# EasyEDA Pro project ProPrj_AT89C52_LCD12864_2025-10-14.epro

# Schematic Schematic1
Board Name: Board1; Create Date: 2025-06-17; Page Name: P1; Project Name: AT89C52_LCD12864; Schematic Name: Schematic1; Update Date: 2025-09-18; Company: 嘉立创EDA; Page Size: A4; Version: V1.0
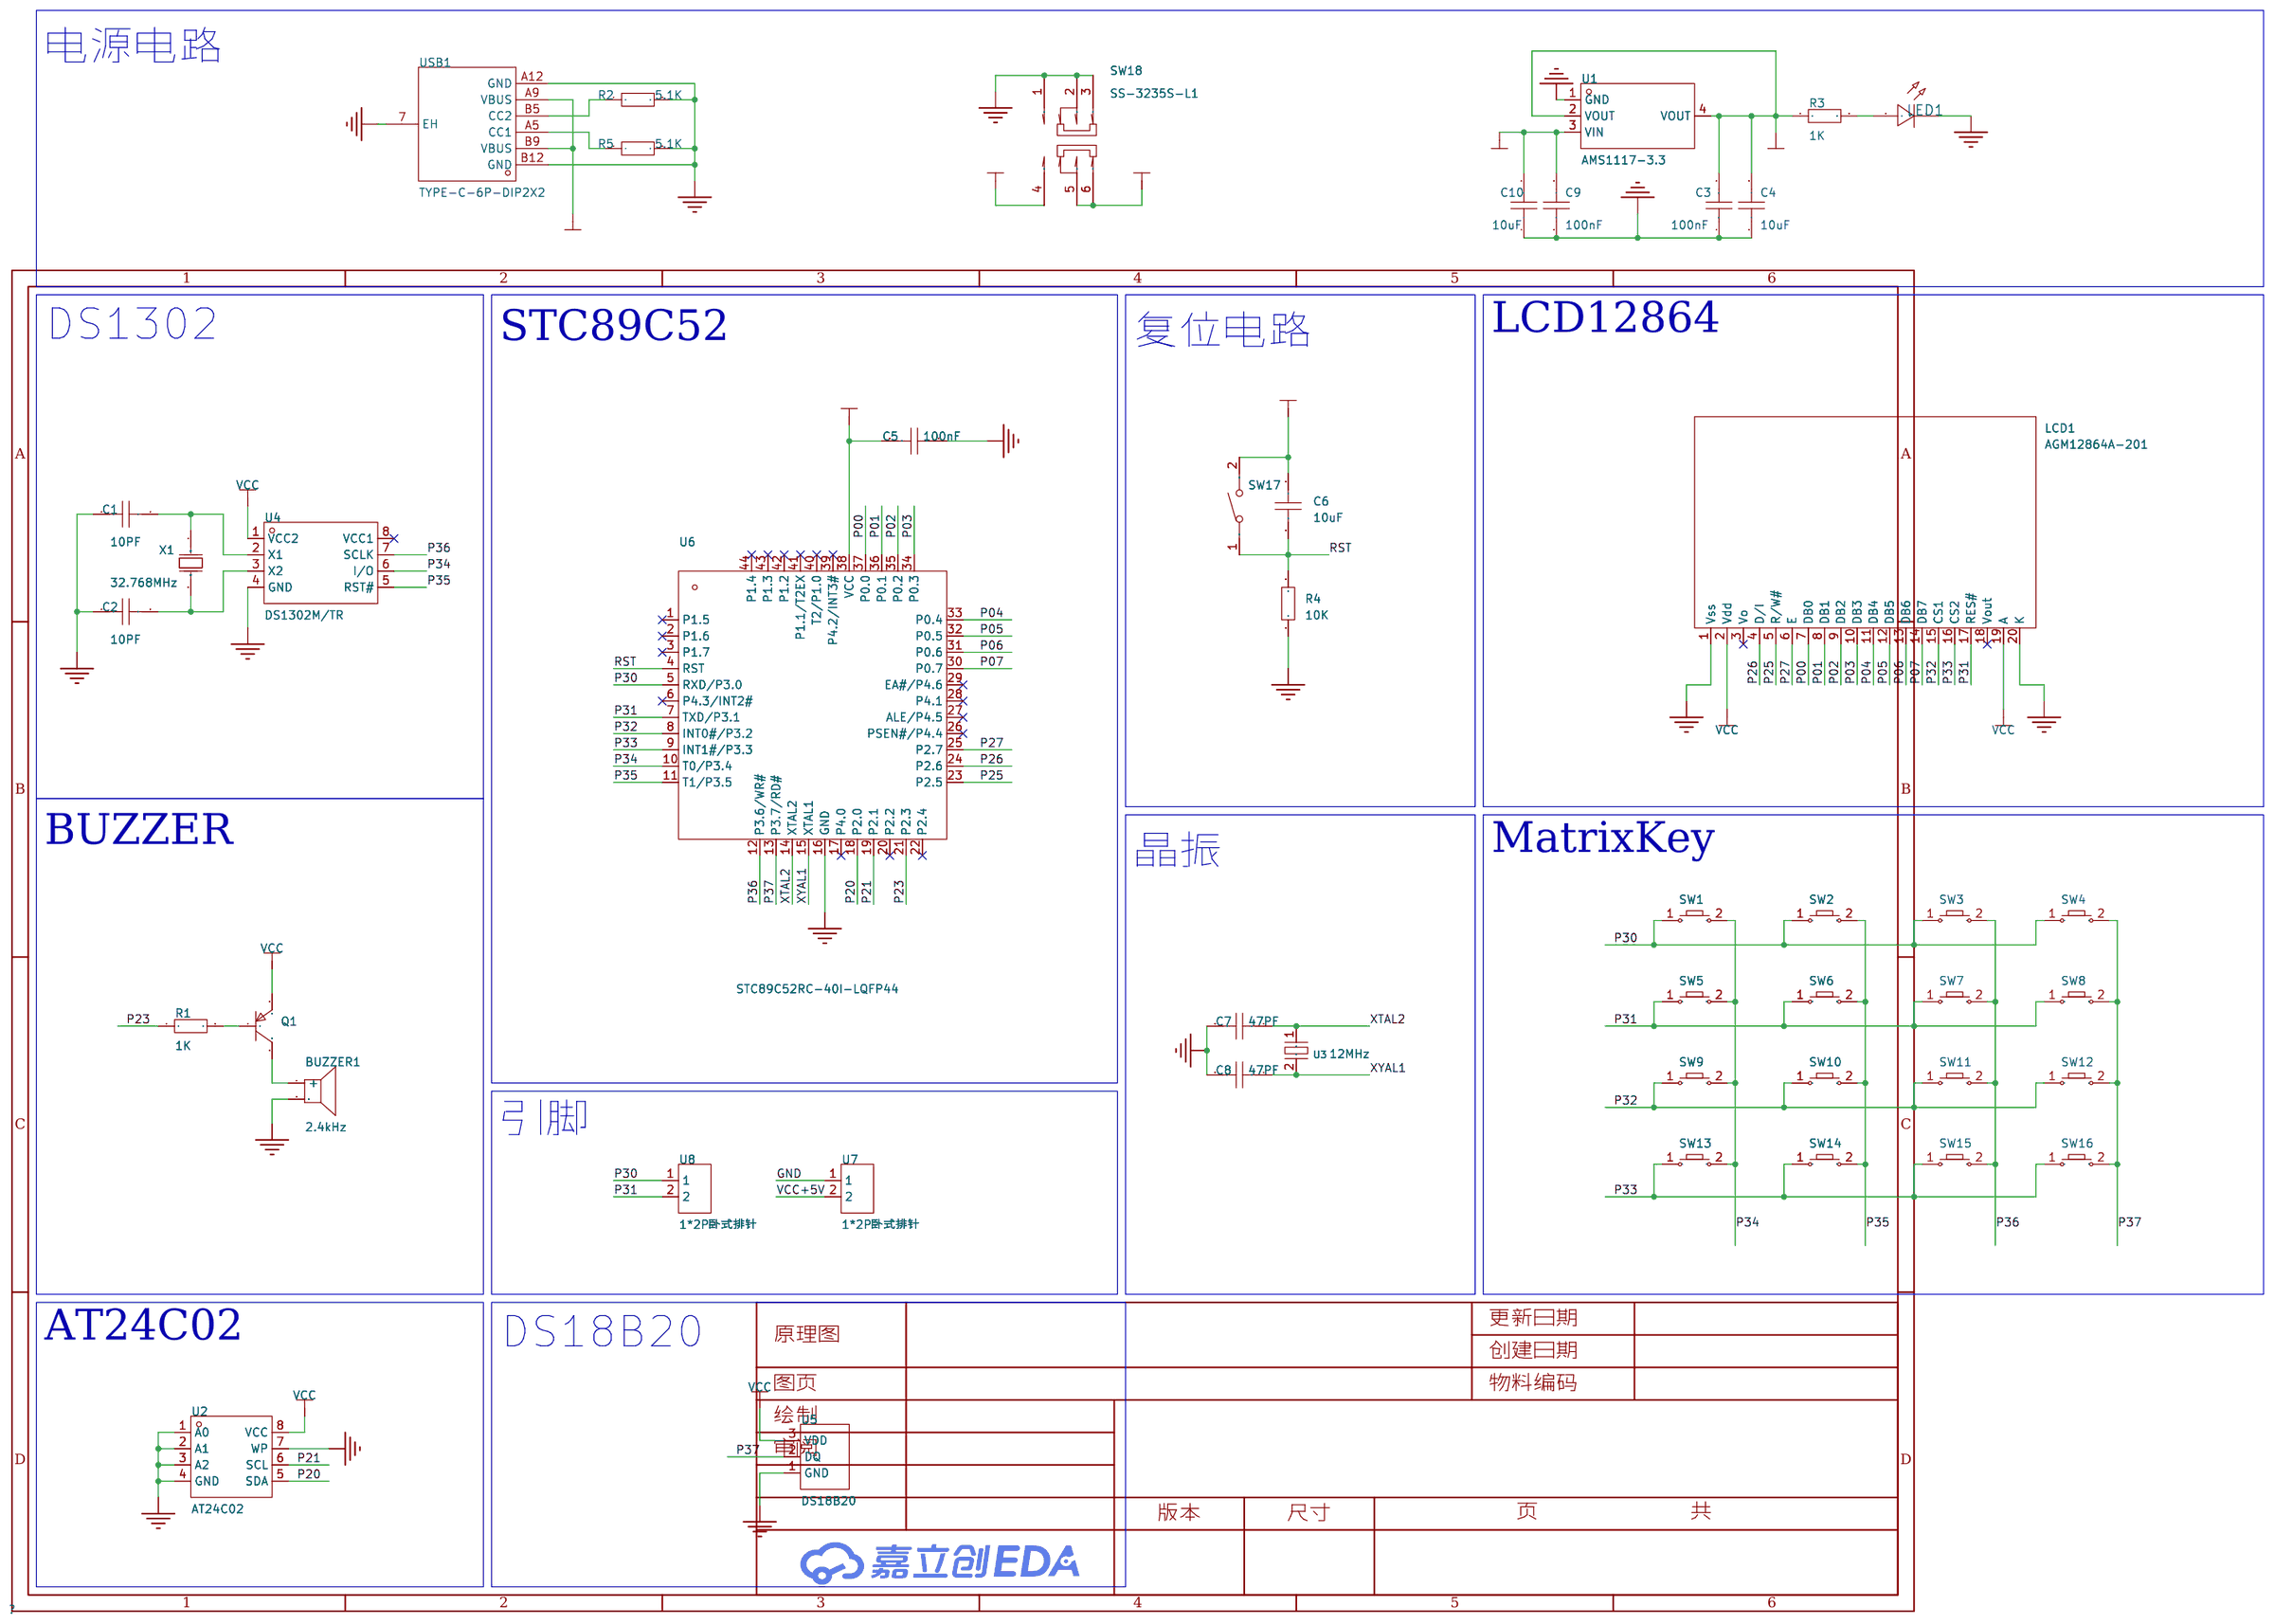
[diagram p0: schematic sheet]

## Parts
BUZZER1  2.4kHz  [BUZ-TH_BD12.0-P7.60-D0.6-FD]
C1  10PF  [C0603]
C2  10PF  [C0603]
C3  100nF  [C0805]
C4  10uF  [C0805]
C5  100nF  [C0805]
C6  10uF  [C0805]
C7  47PF  [C0805]
C8  47PF  [C0805]
C9  100nF  [C0805]
C10  10uF  [C0805]
LCD1  AGM12864A-201  [LCD-TH_20P-L93.0-W70.0-P2.54_AGM12864A-201]
LED1  -  [LED_0805]
Q1  S8550(RANGE:120-200)  [SOT-23-3_L2.9-W1.6-P1.90-LS2.8-BR]
R1  1K  [R0603]
R2  5.1K  [R0805]
R3  1K  [R0805]
R4  10K  [R0805]
R5  5.1K  [R0805]
SW1  -  [Key_SMD_3x4x2]
SW2  -  [Key_SMD_3x4x2]
SW3  -  [Key_SMD_3x4x2]
SW4  -  [Key_SMD_3x4x2]
SW5  -  [Key_SMD_3x4x2]
SW6  -  [Key_SMD_3x4x2]
SW7  -  [Key_SMD_3x4x2]
SW8  -  [Key_SMD_3x4x2]
SW9  -  [Key_SMD_3x4x2]
SW10  -  [Key_SMD_3x4x2]
SW11  -  [Key_SMD_3x4x2]
SW12  -  [Key_SMD_3x4x2]
SW13  -  [Key_SMD_3x4x2]
SW14  -  [Key_SMD_3x4x2]
SW15  -  [Key_SMD_3x4x2]
SW16  -  [Key_SMD_3x4x2]
SW17  轻触按键3*4*H  [SW-SMD_L4.0-W2.9-LS5.0]
SW18  SS-3235S-L1  [SW-SMD_SS-3235S-LX]
U1  AMS1117-3.3  [SOT-223-3_L6.5-W3.4-P2.30-LS7.0-BR]
U2  AT24C02  [SOP-8_L5.0-W4.0-P1.27-LS6.0-BL]
U3  12MHz  [CRYSTAL-SMD_L11.4-W4.7-LS12.7]
U4  DS1302M/TR  [SOP-8_L4.9-W3.9-P1.27-LS6.0-BL]
U5  DS18B20  [TO-92-3_L4.5-W3.5-P1.27-L]
U6  STC89C52RC-40I-LQFP44  [LQFP-44_L10.0-W10.0-P0.80-LS12.0-BL]
U7  1*2P卧式排针  [HDR-SMD_2P-P2.54-V-M_C9900024210]
U8  1*2P卧式排针  [HDR-SMD_2P-P2.54-V-M_C9900024210]
USB1  TYPE-C-6P-DIP2X2  [TYPE-C-SMD_TYPE-C-6P]
X1  32.768MHz  [CRYSTAL-SMD_L11.5-W4.8-LS12.7]

## Library data of the parts
BUZZER1 = TMB12A05_C96093: 驱动方式:有源(内含驱动线路);构造类型:电磁式;额定电压:-;频率:2.4kHz;声压(SPL):85dB;; LCSC Part Name: TMB12A05; Supplier Part: C96093; Manufacturer: 华能; Manufacturer Part: TMB12A05; Supplier Footprint: 插件,D=12mm; JLCPCB Part Class: 扩展库; Datasheet: https://atta.szlcsc.com/upload/public/pdf/source/20241025/8A17FE04D767D19A35A06DEF9A82AB1E.pdf; Supplier: LCSC; Driver Circuitry: 有源(内含驱动线路); Technology: 电磁式; Voltage - Supply: 4V~8V; Sound Pressure Level(SPL): 85dB; Diameter(φD): 12mm; Height: 9.8mm
C1 C2 = CAP_0603: Supplier Footprint: 0603
C3-C10 = CAP_0805: Supplier Footprint: 0805
LCD1 = AGM12864A-201: Supplier Part: C9900143881; Supplier Footprint: 插件; Supplier: LCSC
LED1 = LED_0805-R: Supplier Footprint: 0805
Q1 = S8550(RANGE:120-200): 晶体管类型:PNP;集电极电流(Ic):500mA;集射极击穿电压(Vceo):25V;功率(Pd):300mW;直流电流增益(hFE@Ic,Vce):120@50mA,1V;; LCSC Part Name: PNP 电流:500mA 耐压:25V L档120-200; Supplier Part: C105432; Manufacturer: CJ(江苏长电/长晶); Supplier Footprint: SOT-23; JLCPCB Part Class: 基础库; Datasheet: https://atta.szlcsc.com/upload/public/pdf/source/20171228/C164891_15144412930301213894.pdf; Supplier: LCSC; Transistor Type: PNP; Collector Current (Ic): 500mA; Collector-Emitter Breakdown Voltage (Vceo): 25V; Power Dissipation (Pd): 300mW; DC Current Gain (hFE@Ic,Vce): 120@50mA,1V; Transition Frequency (fT): 150MHz; Collector Cut-Off Current (Icbo): 100nA; Collector-Emitter Saturation Voltage (VCE(sat)@Ic,Ib): 600mV@500mA,50mA; Operating Temperature: -55℃~+150℃
R1 = Res_0603: Supplier Footprint: 0603
R2-R5 = Res_0805: Supplier Footprint: 0805
SW1-SW16 = Key_SMD_3x4x2: Supplier Footprint: SMD
SW17 = 轻触按键3*4*H: Supplier Part: C9900017573; Supplier Footprint: 轻触按键3*4*2.5; JLCPCB Part Class: 扩展库; Supplier: LCSC
SW18 = SS-3235S-L1: 电路结构:双刀双掷;安装方式:卧贴;开关颜色:黑色;额定电流(DC):50mA;额定电压(DC):12V;额定电流(AC):50mA;额定电压(AC):12V;机械寿命:1万次;; LCSC Part Name: 柄长2mm 卧贴双档 滑动开关; Supplier Part: C500055; Manufacturer: XKB Connectivity(中国星坤); Supplier Footprint: SMD; JLCPCB Part Class: 扩展库; Datasheet: https://atta.szlcsc.com/upload/public/pdf/source/20211011/39D516E750C13BE9339464E723D9F132.pdf; Supplier: LCSC; Circuit: 双刀双掷; Actuator Style: 矩形柱状; Pin Style: 鸥翼型; Switch Length: 9.1mm; Switch Width: 3.55mm; Switch Height: 3.2mm; Mounting Style: 卧贴; Actuator Color: 黑色; Current Rating (DC): 50mA; Voltage Rating (DC): 12V; Current Rating (AC): 50mA; Voltage Rating (AC): 12V; Mechanical Life: 1万次; Operating Temperature: -40℃~+85℃
U1 = AMS1117-3.3_C6186: 输出类型:固定;最大输入电压:-;输出电压:3.3V;最大输出电流:1A;电源纹波抑制比(PSRR):72dB@(120Hz);输出极性:正极;; LCSC Part Name: 输出3.3V 1A; Supplier Part: C6186; Manufacturer: AMS; Supplier Footprint: SOT-223; JLCPCB Part Class: 基础库; Datasheet: https://atta.szlcsc.com/upload/public/pdf/source/20180727/C6186_7A095716F0823C02F1997A905E26C086.pdf; Supplier: LCSC; Output Type: 固定; Output Voltage: 3.3V; MAX Output Current: 1A; Power Supply Rejection Ratio (PSRR): 72dB@(120Hz); Dropout Voltage: 1.3V@(800mA); Output Polarity: 正极; Number of Outputs: 1
U2 = AT24C02_C688857: 24C02是一款2K位的电可擦除PROM，采用8-pin PDIP、8-pin SOP和5-pin SOT23-5封装。支持I2C两线串行接口，工作电压1.8V~5.5V，具有页写能力和硬件数据写保护。; LCSC Part Name: 24C02 2Kbit电可擦除PROM; Supplier Part: C688857; Manufacturer: IDCHIP(英锐芯); Supplier Footprint: SOP-8; JLCPCB Part Class: 扩展库; Datasheet: https://atta.szlcsc.com/upload/public/pdf/source/20200619/C688857_168265888F77B455D6D4136881F4BB15.pdf; Supplier: LCSC
U3 = ABLS-12.000MHZ-30-A-4-H-T: 频率:12MHz;常温频差:±30ppm;外接负载电容:30pF;频率稳定度(全温):±35ppm;; LCSC Part Name: 12MHz ±30ppm 30pF; Supplier Part: C1987121; Manufacturer: ABRACON; Supplier Footprint: HC-49S-SMD; JLCPCB Part Class: 扩展库; Datasheet: https://atta.szlcsc.com/upload/public/pdf/source/20210612/96A8D0E14BE5C26ADD56CBF11909D043.pdf; Supplier: LCSC; Normal temperature Frequency Tolerance: ±30ppm; External load capacitor: 30pF; Frequency Stability(Full temperature range): ±35ppm; Equivalent Series Resistance (ESR): 50Ω; Operating Temperature: -10℃~+60℃
U4 = DS1302M/TR: Supplier Part: C434511; Manufacturer: HGSEMI(华冠); Supplier Footprint: SOP-8; JLCPCB Part Class: 扩展库; Datasheet: https://atta.szlcsc.com/upload/public/pdf/source/20200917/C398065_5315ADAE953F50FA1591ED23DB33A00E.pdf; Supplier: LCSC
U5 = DS18B20: 温度范围:-;精度:±0.4℃;接口类型:-;; LCSC Part Name: 温度-10℃~70℃ 精度±0.4℃ 电压2.5V~5.5V; Supplier Part: C5451632; Manufacturer: HXY MOSFET(华轩阳电子); Supplier Footprint: TO-92; Datasheet: https://item.szlcsc.com/datasheet/DS18B20/6355375.html; Supplier: LCSC; Tolerance: ±0.4℃; Voltage - Supply: 2.5V~5.5V
U6 = STC89C52RC-40I-LQFP44: CPU内核:51系列;程序存储容量:8KB;RAM总容量:512Byte;GPIO端口数量:39;工作电压范围:3.3V~5.5V;CPU最大主频:-;程序存储器类型:FLASH;; Supplier Part: C8707; Manufacturer: STC(宏晶); Supplier Footprint: LQFP-44(10x10); JLCPCB Part Class: 扩展库; Datasheet: https://atta.szlcsc.com/upload/public/pdf/source/20131218/1457706663573.pdf; Supplier: LCSC; CPU Core: 51系列; Program Storage Size: 8KB; RAM Size: 512Byte; GPIO Ports Number: 39; Operating Voltage Range: 3.3V~5.5V; Program Memory Type: FLASH; Operating Temperature Range: -40℃~+85℃; 16Bit Timer: 3; UART/USART: 1; Peripheral/Function: 看门狗; Watchdog: 有
U7 U8 = 1*2P卧式排针: Supplier Part: C9900024210; Supplier Footprint: 排针间距: 2.54*2.3; JLCPCB Part Class: 扩展库; Supplier: LCSC
USB1 = TYPE-C-6P-DIP2X2: Supplier Part: C9900017627; Supplier Footprint: TYPE-C-6P; JLCPCB Part Class: 扩展库; Supplier: LCSC
X1 = X49SM8MSD2SC: 晶振类型:贴片晶振;频率:8MHz;常温频差:±20ppm;负载电容:20pF;频率稳定度:±30ppm;; LCSC Part Name: HC-49SMD 8MHZ 2P 49SMD 20PF ±20PPM -20~70℃（±30PPM）; Supplier Part: C12674; Manufacturer: YXC(扬兴晶振); Supplier Footprint: HC-49S-SMD; JLCPCB Part Class: 基础库; Datasheet: https://item.szlcsc.com/datasheet/X49SM8MSD2SC/13310.html; Supplier: LCSC; Type: 贴片晶振; Normal temperature Frequency Tolerance: ±20ppm; Load Capacitance: 20pF; Frequency Stability: ±30ppm; Operating Temperature: -20℃~+70℃

## Nets
3.3V: C3.2 C4.2 R3.1 U1.2(VOUT) U1.4(VOUT)
GND: BUZZER1.2 C1.1 C2.1 C3.1 C4.1 C5.1 C7.2 C8.2 C9.1 C10.1 LCD1.1(Vss) LCD1.20(K) LED1.1(C) R2.2 R4.1 R5.2 SW18.1 SW18.2 SW18.3 U1.1(GND) U2.1(A0) U2.2(A1) U2.3(A2) U2.4(GND) U2.7(WP) U4.4(GND) U5.1(GND) U6.16(GND) U7.1 USB1.7(EH) USB1.A12(GND) USB1.B12(GND)
VCC: C5.2 C6.1 C9.2 C10.2 LCD1.2(Vdd) LCD1.19(A) Q1.2 SW17.2 SW18.5 SW18.6 U1.3(VIN) U2.8(VCC) U4.1(VCC2) U5.3(VDD) U6.38(VCC)
VCC+5V: SW18.4 U7.2 USB1.A9(VBUS) USB1.B9(VBUS)
P00: LCD1.7(DB0) U6.37(P0.0)
P01: LCD1.8(DB1) U6.36(P0.1)
P02: LCD1.9(DB2) U6.35(P0.2)
P03: LCD1.10(DB3) U6.34(P0.3)
P04: LCD1.11(DB4) U6.33(P0.4)
P05: LCD1.12(DB5) U6.32(P0.5)
P06: LCD1.13(DB6) U6.31(P0.6)
P07: LCD1.14(DB7) U6.30(P0.7)
P20: U2.5(SDA) U6.18(P2.0)
P21: U2.6(SCL) U6.19(P2.1)
P23: R1.1 U6.21(P2.3)
P25: LCD1.5(R/W#) U6.23(P2.5)
P26: LCD1.4(D/I) U6.24(P2.6)
P27: LCD1.6(E) U6.25(P2.7)
P30: SW1.1 SW2.1 SW3.1 SW4.1 U6.5(RXD/P3.0) U8.1
P31: LCD1.17(RES#) SW5.1 SW6.1 SW7.1 SW8.1 U6.7(TXD/P3.1) U8.2
P32: LCD1.15(CS1) SW9.1 SW10.1 SW11.1 SW12.1 U6.8(INT0#/P3.2)
P33: LCD1.16(CS2) SW13.1 SW14.1 SW15.1 SW16.1 U6.9(INT1#/P3.3)
P34: SW1.2 SW5.2 SW9.2 SW13.2 U4.6(I/O) U6.10(T0/P3.4)
P35: SW2.2 SW6.2 SW10.2 SW14.2 U4.5(RST#) U6.11(T1/P3.5)
P36: SW3.2 SW7.2 SW11.2 SW15.2 U4.7(SCLK) U6.12(P3.6/WR#)
P37: SW4.2 SW8.2 SW12.2 SW16.2 U5.2(DQ) U6.13(P3.7/RD#)
RST: C6.2 R4.2 SW17.1 U6.4(RST)
XTAL2: C7.1 U3.1 U6.14(XTAL2)
XYAL1: C8.1 U3.2(GND) U6.15(XTAL1)
$1N2520: Q1.1 R1.2
$1N2524: BUZZER1.1(+) Q1.3
$1N3833: C1.2 U4.2(X1) X1.1(OSC1)
$1N3840: C2.2 U4.3(X2) X1.2(OSC2)
$1N9572: R2.1 USB1.B5(CC2)
$1N9573: R5.1 USB1.A5(CC1)
$1N9582: LED1.2(A) R3.2

Not connected (* = marked no-connect by the designer): LCD1 3(Vo)* 18(Vout)*; U4 8(VCC1)*; U6 1(P1.5)* 2(P1.6)* 3(P1.7)* 6(P4.3/INT2#)* 17(P4.0)* 20(P2.2)* 22(P2.4)* 26(PSEN#/P4.4)* 27(ALE/P4.5)* 28(P4.1)* 29(EA#/P4.6)* 39(P4.2/INT3#)* 40(T2/P1.0)* 41(P1.1/T2EX)* 42(P1.2)* 43(P1.3)* 44(P1.4)*

## Notes on the sheet
- 电源电路
- DS1302
- LCD12864
- STC89C52
- 复位电路
- BUZZER
- MatrixKey
- 晶振
- 引脚
- AT24C02
- DS18B20

# Board PCB1
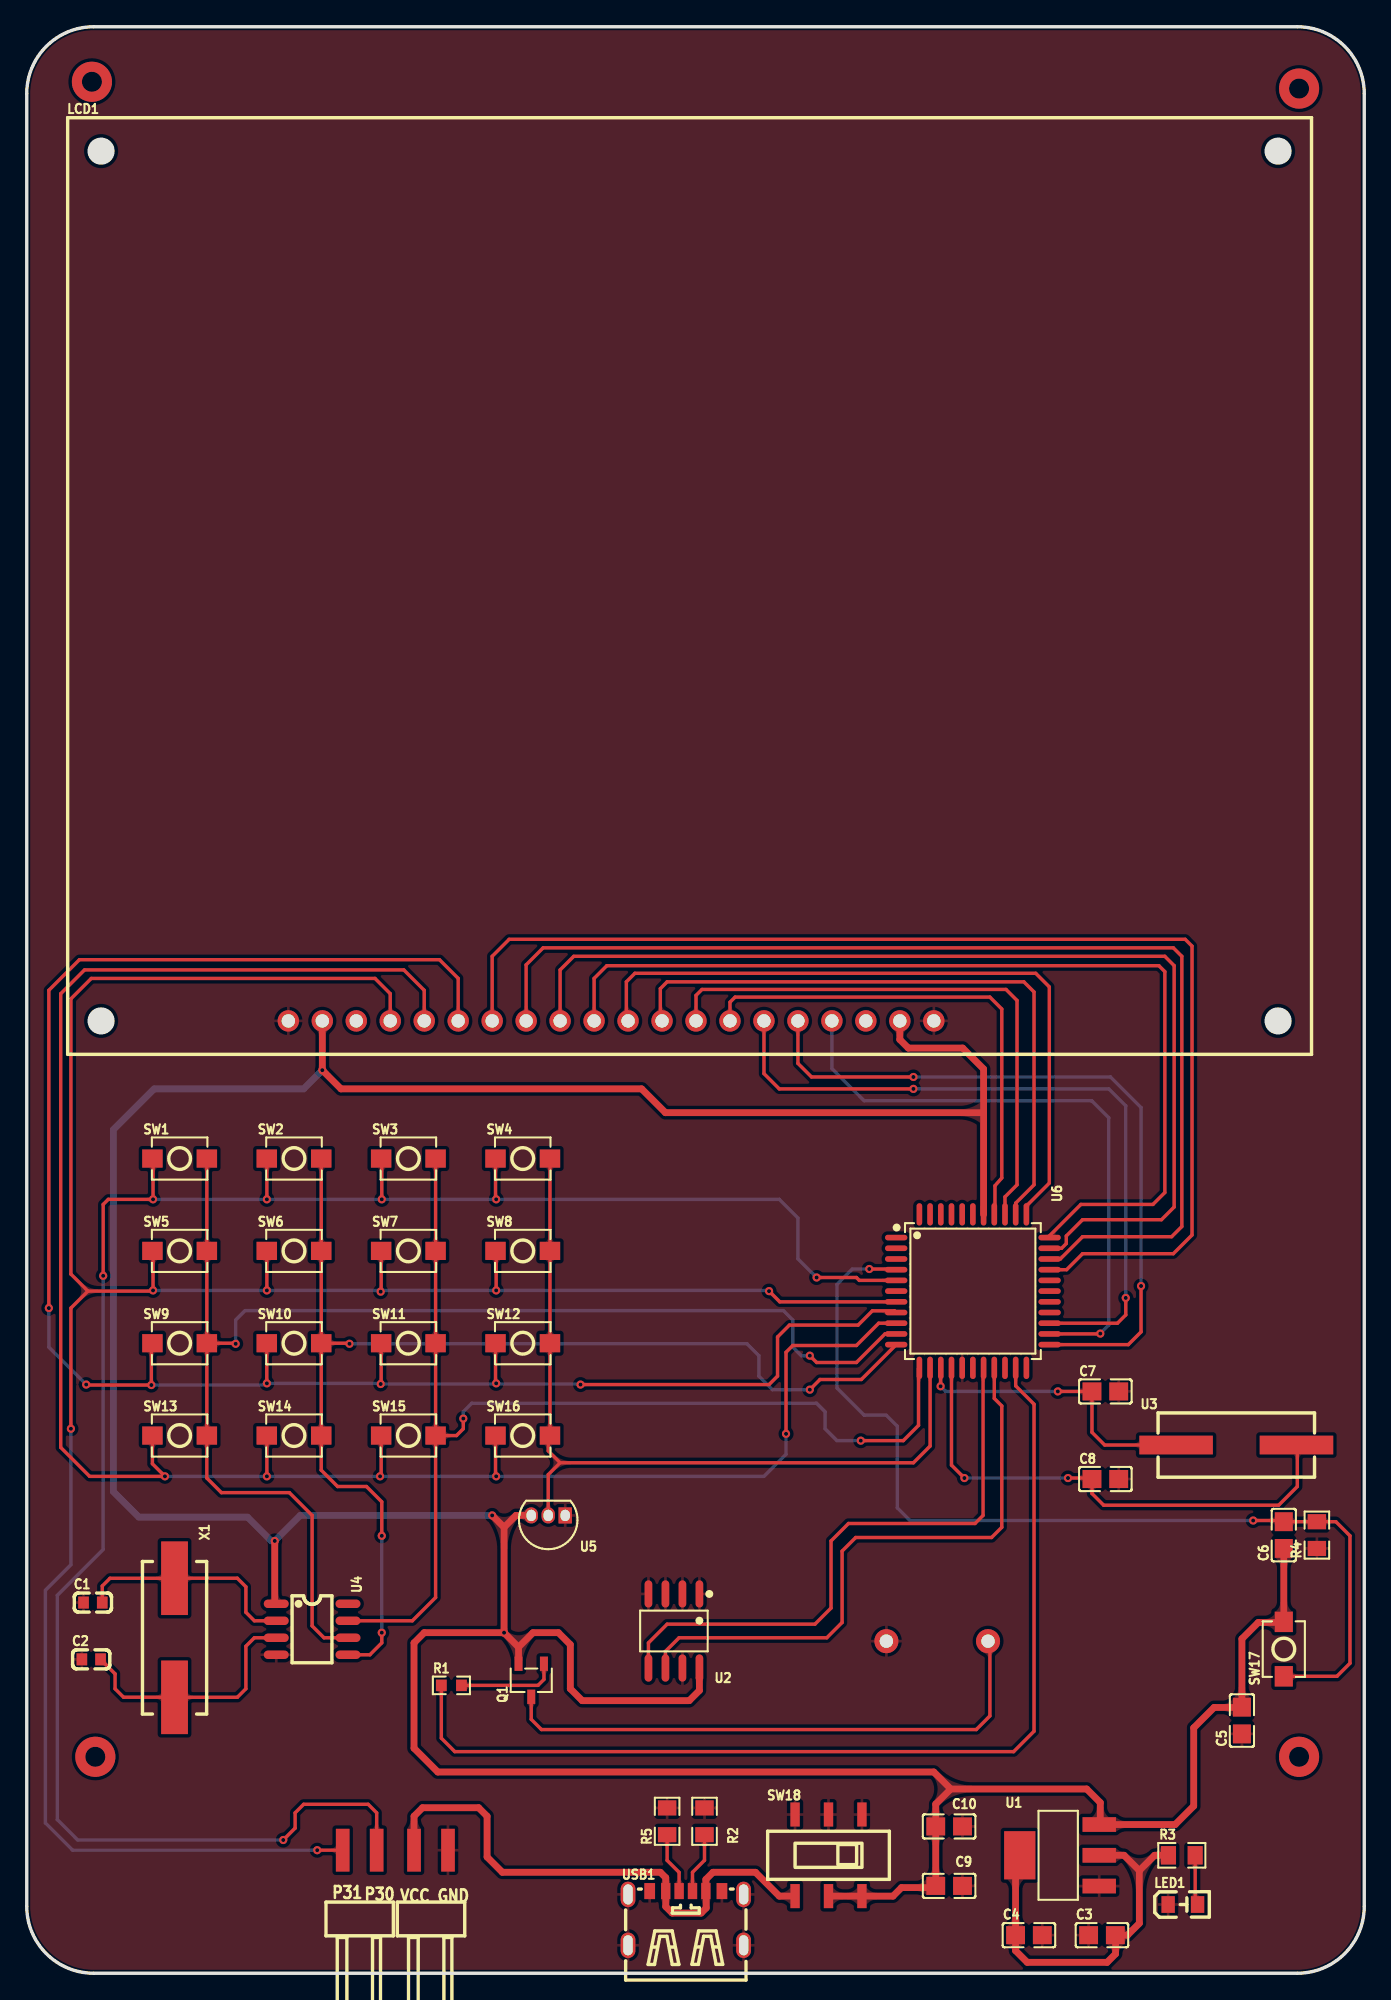
[diagram p1: board, top side]
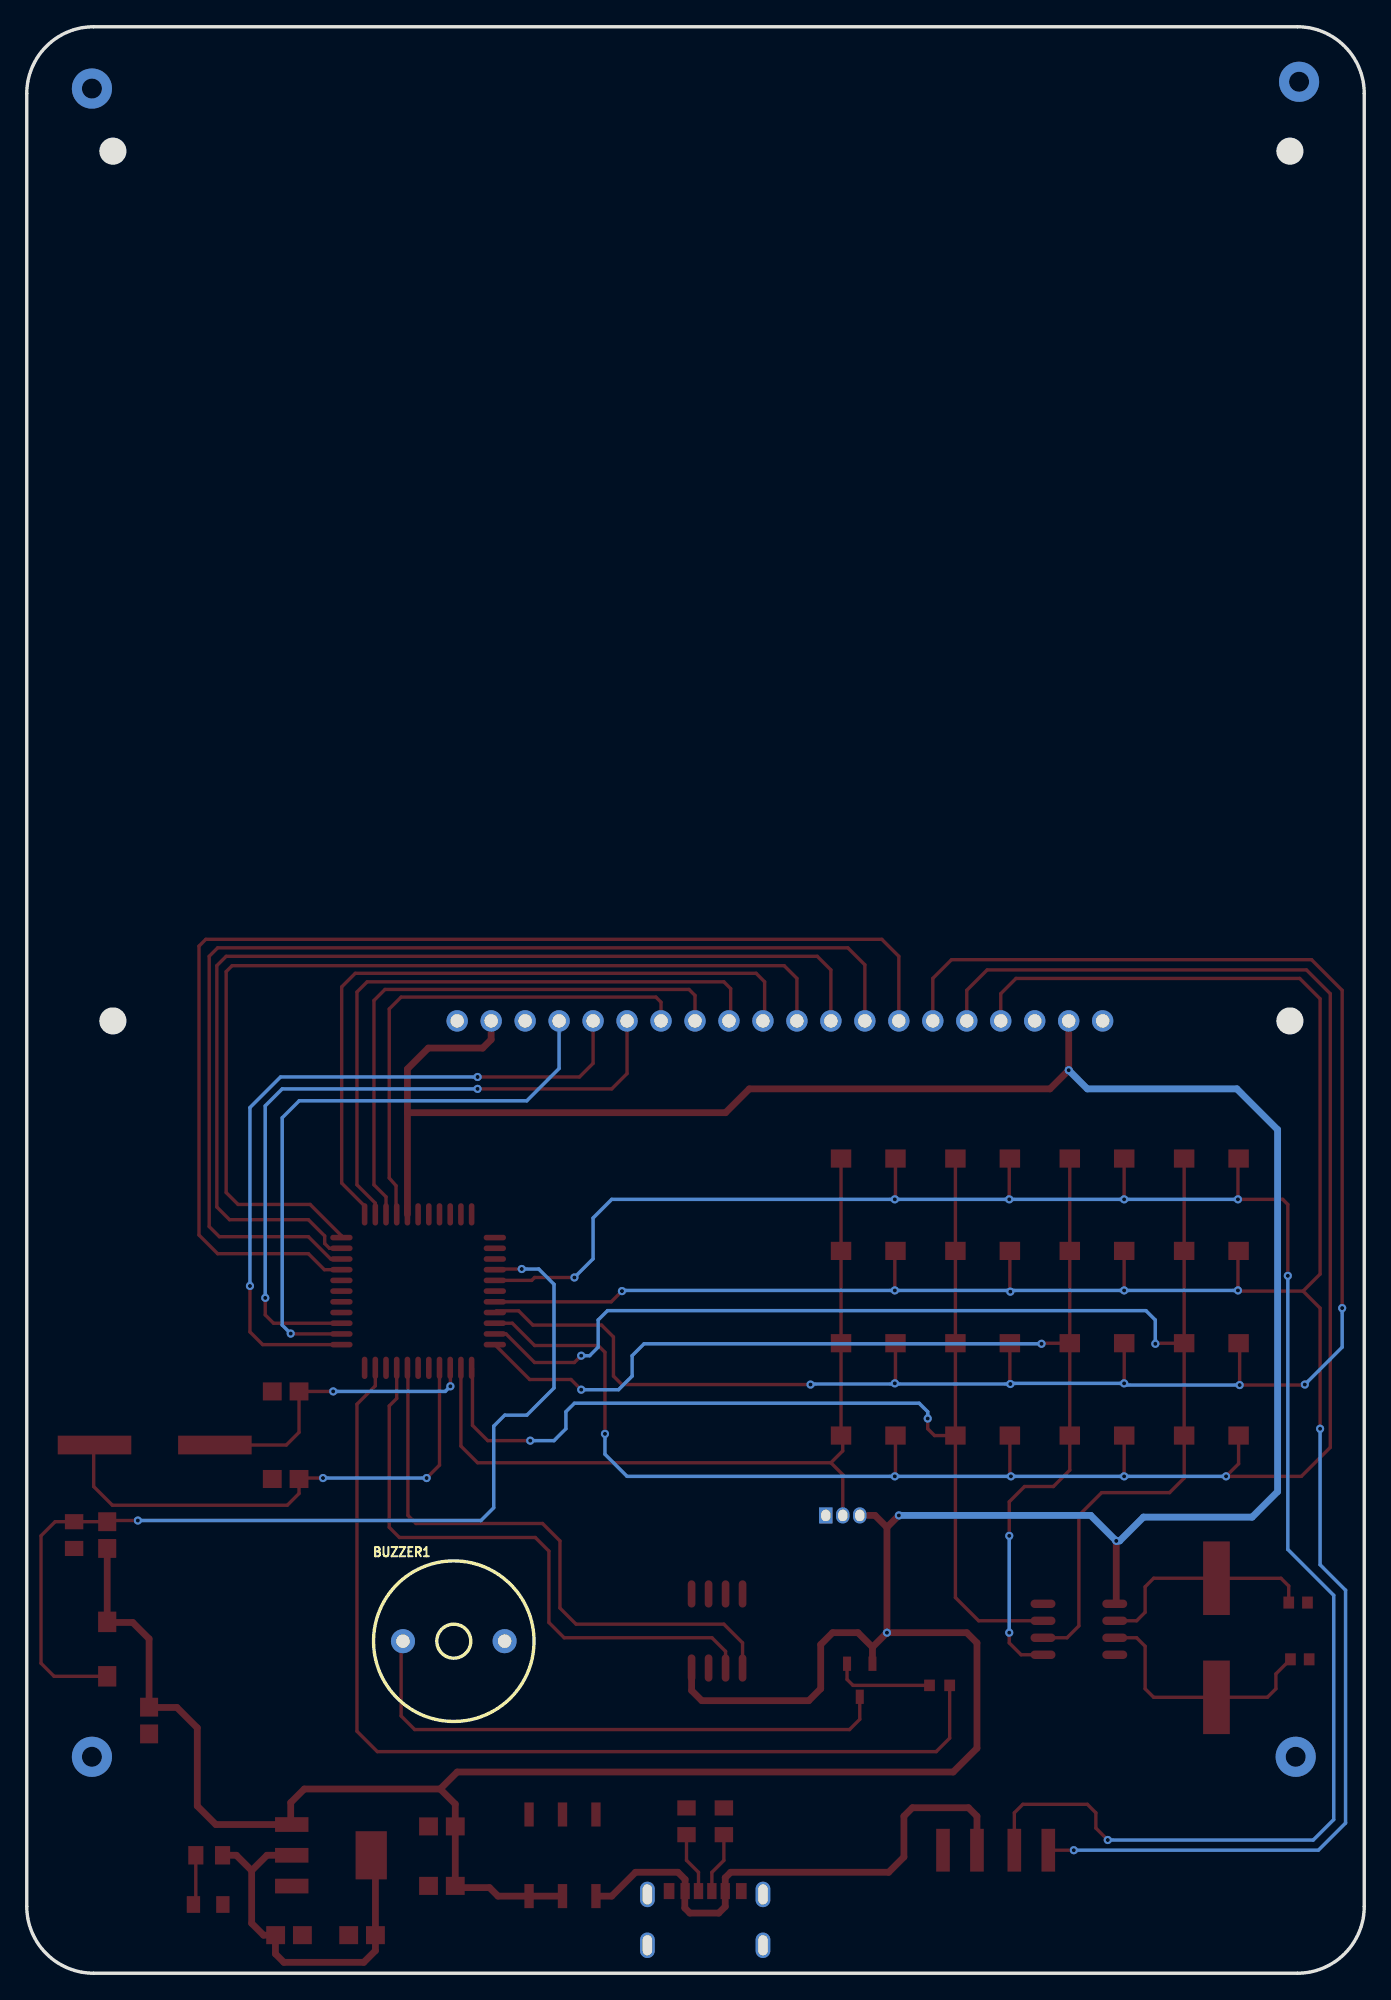
[diagram p2: board, bottom side, seen from below]

Outline 100 x 145.47 mm; copper layers: Top Layer, Bottom Layer. Coordinates in mm from the lower left corner of the outline.
Outline path: 0,140.47 0,5 arc(1.46,1.46) 5,0 95,0 arc(98.54,1.46) 100,5 100,140.47 arc(98.54,144) 95,145.47 5,145.47 arc(1.46,144) 0,140.47
Stack: Top Layer 0.035mm / Dielectric1 1.51mm FR4 er 4.5 / Bottom Layer 0.035mm

## Design rules (mm)
template: JLCPCB Capability(Two Layers Board)
spacing copperThickness1oz (default): track to track 0.102, other pairs 0.152 to 0.3
spacing copperThickness2oz: track to track 0.203, other pairs 0.152 to 0.3
track width copperThickness1oz (default): min 0.127, default 0.254, max 2.54
track width copperThickness2oz: min 0.203, default 0.254, max 2.54
differential pair differentialPair (default): width min 0.127, default 0.254, max 2.54; gap min 0.152, default 0.152
via viaSize (default): diameter min 0.5, default 0.61, max 10; hole min 0.3, default 0.305, max 6.3

## Placement (name value [footprint] x y rotation side)
BUZZER1  2.4kHz  [BUZ-TH_BD12.0-P7.60-D0.6-FD]  68.07 24.82 180 bottom
C1  10PF  [C0603]  4.95 27.7 0 top
C2  10PF  [C0603]  4.82 23.46 0 top
C3  100nF  [C0805]  80.39 2.84 0 top
C4  10uF  [C0805]  74.93 2.84 180 top
C5  100nF  [C0805]  90.85 18.88 90 top
C6  10uF  [C0805]  93.99 32.74 90 top
C7  47PF  [C0805]  80.64 43.48 0 top
C8  47PF  [C0805]  80.64 36.93 0 top
C9  100nF  [C0805]  68.96 6.53 180 top
C10  10uF  [C0805]  68.96 10.97 180 top
LCD1  AGM12864A-201  [LCD-TH_20P-L93.0-W70.0-P2.54_AGM12864A-201]  43.69 71.17 0 top
LED1  -  [LED_0805]  86.49 5.13 0 top
Q1  S8550(RANGE:120-200)  [SOT-23-3_L2.9-W1.6-P1.90-LS2.8-BR]  37.72 21.89 90 top
R1  1K  [R0603]  31.75 21.51 0 top
R2  5.1K  [R0805]  50.67 11.35 90 top
R3  1K  [R0805]  86.36 8.81 0 top
R4  10K  [R0805]  96.46 32.74 90 top
R5  5.1K  [R0805]  47.88 11.35 90 top
SW1  -  [Key_SMD_3x4x2]  11.43 60.88 0 top
SW2  -  [Key_SMD_3x4x2]  19.98 60.88 0 top
SW3  -  [Key_SMD_3x4x2]  28.53 60.88 0 top
SW4  -  [Key_SMD_3x4x2]  37.08 60.88 0 top
SW5  -  [Key_SMD_3x4x2]  11.43 53.98 0 top
SW6  -  [Key_SMD_3x4x2]  19.98 53.98 0 top
SW7  -  [Key_SMD_3x4x2]  28.53 53.98 0 top
SW8  -  [Key_SMD_3x4x2]  37.08 53.98 0 top
SW9  -  [Key_SMD_3x4x2]  11.43 47.08 0 top
SW10  -  [Key_SMD_3x4x2]  19.98 47.08 0 top
SW11  -  [Key_SMD_3x4x2]  28.53 47.08 0 top
SW12  -  [Key_SMD_3x4x2]  37.08 47.08 0 top
SW13  -  [Key_SMD_3x4x2]  11.43 40.18 0 top
SW14  -  [Key_SMD_3x4x2]  19.98 40.18 0 top
SW15  -  [Key_SMD_3x4x2]  28.53 40.18 0 top
SW16  -  [Key_SMD_3x4x2]  37.08 40.18 0 top
SW17  轻触按键3*4*H  [SW-SMD_L4.0-W2.9-LS5.0]  93.99 24.22 90 top
SW18  SS-3235S-L1  [SW-SMD_SS-3235S-LX]  59.94 8.81 0 top
U1  AMS1117-3.3  [SOT-223-3_L6.5-W3.4-P2.30-LS7.0-BR]  77.22 8.81 0 top
U2  AT24C02  [SOP-8_L5.0-W4.0-P1.27-LS6.0-BL]  48.39 25.58 180 top
U3  12MHz  [CRYSTAL-SMD_L11.4-W4.7-LS12.7]  90.43 39.47 0 top
U4  DS1302M/TR  [SOP-8_L4.9-W3.9-P1.27-LS6.0-BL]  21.34 25.7 270 top
U5  DS18B20  [TO-92-3_L4.5-W3.5-P1.27-L]  38.99 34.21 180 top
U6  STC89C52RC-40I-LQFP44  [LQFP-44_L10.0-W10.0-P0.80-LS12.0-BL]  70.74 50.98 270 top
U7  1*2P卧式排针  [HDR-SMD_2P-P2.54-V-M_C9900024210]  30.23 9.19 180 top
U8  1*2P卧式排针  [HDR-SMD_2P-P2.54-V-M_C9900024210]  24.89 9.19 180 top
USB1  TYPE-C-6P-DIP2X2  [TYPE-C-SMD_TYPE-C-6P]  49.28 4.11 0 top
X1  32.768MHz  [CRYSTAL-SMD_L11.5-W4.8-LS12.7]  11.05 25.07 270 top

## Footprints (pads in the part's own frame, mm; a bottom-side part is the same pattern mirrored in y, then rotated)
BUZ-TH_BD12.0-P7.60-D0.6-FD
  round 1.8 hole 1: 1(-3.8,0) 2(3.8,0)
C0603
  rect 0.8x0.9 smd: 1(-0.7,0) 2(0.7,0)
C0805
  rect 1.41x1.35 smd: 1(-1,0) 2(1,0)
CRYSTAL-SMD_L11.4-W4.7-LS12.7
  rect 5.5x1.4 smd: 1(-4.5,0) 2(4.5,0)
CRYSTAL-SMD_L11.5-W4.8-LS12.7
  rect 5.5x2 smd: 1(-4.45,0) 2(4.45,0)
HDR-SMD_2P-P2.54-V-M_C9900024210
  rect 1.02x3.2 smd: 1(-1.27,0) 2(1.27,0)
Key_SMD_3x4x2
  rect 1.53x1.36 smd: 1(-2.035,0) 2(2.035,0)
LCD-TH_20P-L93.0-W70.0-P2.54_AGM12864A-201
  round 1.6 hole 1: 1(24.13,0) 2(21.59,0) 3(19.05,0) 4(16.51,0) 5(13.97,0) 6(11.43,0) 7(8.89,0) 8(6.35,0) 9(3.81,0) 10(1.27,0) 11(-1.27,0) 12(-3.81,0) 13(-6.35,0) 14(-8.89,0) 15(-11.43,0) 16(-13.97,0) 17(-16.51,0) 18(-19.05,0) 19(-21.59,0) 20(-24.13,0)
LED_0805
  rect 1x1.25 smd: 1(-1.15,0.005) 2(1.05,0.005)
LQFP-44_L10.0-W10.0-P0.80-LS12.0-BL
  oval 0.42x1.67 smd: 1(-4,-5.735) 2(-3.2,-5.735) 3(-2.4,-5.735) 4(-1.6,-5.735) 5(-0.8,-5.735) 6(0,-5.735) 7(0.8,-5.735) 8(1.6,-5.735) 9(2.4,-5.735) 10(3.2,-5.735) 11(4,-5.735) 23(4,5.735) 24(3.2,5.735) 25(2.4,5.735) 26(1.6,5.735) 27(0.8,5.735) 28(0,5.735) 29(-0.8,5.735) 30(-1.6,5.735) 31(-2.4,5.735) 32(-3.2,5.735) 33(-4,5.735)
  oval 1.67x0.42 smd: 12(5.735,-4) 13(5.735,-3.2) 14(5.735,-2.4) 15(5.735,-1.6) 16(5.735,-0.8) 17(5.735,0) 18(5.735,0.8) 19(5.735,1.6) 20(5.735,2.4) 21(5.735,3.2) 22(5.735,4) 34(-5.735,4) 35(-5.735,3.2) 36(-5.735,2.4) 37(-5.735,1.6) 38(-5.735,0.8) 39(-5.735,0) 40(-5.735,-0.8) 41(-5.735,-1.6) 42(-5.735,-2.4) 43(-5.735,-3.2) 44(-5.735,-4)
R0603
  rect 0.806x0.864 smd: 1(-0.753,0) 2(0.753,0)
R0805
  rect 1.133x1.377 smd: 1(-1,0) 2(1,0)
SOP-8_L4.9-W3.9-P1.27-LS6.0-BL
  oval 0.63x1.865 smd: 1(-1.905,-2.683) 2(-0.635,-2.683) 3(0.635,-2.683) 4(1.905,-2.683) 5(1.905,2.683) 6(0.635,2.683) 7(-0.635,2.683) 8(-1.905,2.683)
SOP-8_L5.0-W4.0-P1.27-LS6.0-BL
  oval 0.574x2.035 smd: 1(-1.905,-2.768) 2(-0.635,-2.768) 3(0.635,-2.768) 4(1.905,-2.768) 5(1.905,2.768) 6(0.635,2.768) 7(-0.635,2.768) 8(-1.905,2.768)
SOT-23-3_L2.9-W1.6-P1.90-LS2.8-BR
  rect 1.07x0.6 smd: 1(1.235,-0.95) 2(1.235,0.95) 3(-1.235,0)
SOT-223-3_L6.5-W3.4-P2.30-LS7.0-BR
  rect 2.5x1.1 smd: 1(2.97,-2.3) 2(2.97,0) 3(2.97,2.3)
  rect 2.34x3.6 smd: 4(-2.97,0)
SW-SMD_L4.0-W2.9-LS5.0
  rect 1.53x1.36 smd: 1(-2.035,0) 2(2.035,0)
SW-SMD_SS-3235S-LX
  rect 0.7x1.8 smd: 1(-2.5,3.05) 2(0,3.05) 3(2.5,3.05) 4(-2.5,-3.05) 5(0,-3.05) 6(2.5,-3.05)
TO-92-3_L4.5-W3.5-P1.27-L
  rect 1x1.2 hole 0.7x0.85: 1(-1.27,0)
  oval 1x1.2 hole 0.7x0.85: 2(0,0) 3(1.27,0)
TYPE-C-SMD_TYPE-C-6P
  oval 1.1x1.9 hole 0.7x1.5: 7(-4.32,1.775) 7(-4.32,-2.025) 7(4.32,1.775) 7(4.32,-2.025)
  rect 0.7x1.2 smd: A5(-0.5,2.025) A9(1.5,2.025) B5(0.5,2.025) B9(-1.5,2.025)
  rect 0.8x1.2 smd: A12(2.7,2.025) B12(-2.7,2.025)

## Nets
As in the schematic.

Pads without a net: LCD1 3 18; U4 8; U6 1 2 3 6 17 20 22 26 27 28 29 39 40 41 42 43 44

## Via types
v1: diameter 3, hole 1.5, Top Layer to Bottom Layer, 4 vias
v2: diameter 0.61, hole 0.305, Top Layer to Bottom Layer, 49 vias

## Routing (per net, layer and track width the routed paths; a pad name or vN(x,y) marks a point on that pad's centre or on a via; arc(x,y) is an arc through that point)
3.3V: length 29
  Top Layer w0.508: 83.19,7.67 83.19,3.73 82.3,2.84 C3.2 81.41,2.83 81.41,1.45 80.77,0.81 74.8,0.81 73.93,1.69 C4.2 73.93,8.5 U1.4 ; 83.19,7.67 84.33,8.81 R3.1 ; 83.19,7.67 82.04,8.81 U1.2
VCC: length 305.7
  Top Layer w0.508: 36.77,24.37 37.85,25.45 39.75,25.45 40.64,24.56 40.64,21.26 41.53,20.37 49.53,20.37 50.29,21.13 U2.8 ; 36.77,24.37 Q1.2 ; 36.77,24.37 v2(35.69,25.45) ; v2(35.69,25.45) 29.72,25.45 28.96,24.69 28.96,16.81 30.73,15.04 67.82,15.04 69.09,13.77 ; v2(35.69,25.45) 35.69,33.32 ; 71.54,64.31 47.75,64.31 45.97,66.09 23.5,66.09 v2(22.1,67.49) LCD1.19 ; 69.09,13.77 79.25,13.77 80.26,12.75 80.26,11.19 U1.3 85.87,11.11 87.25,12.5 87.25,18.34 88.77,19.86 90.83,19.86 C5.2 90.85,24.99 92.08,26.21 93.94,26.21 SW17.2 C6.1 ; 69.09,13.77 67.96,12.64 C10.2 C9.2 67.83,6.4 65.41,6.4 64.77,5.76 SW18.6 SW18.5 ; U4.1 18.54,27.72 v2(18.54,32.31) ; 35.69,33.32 v2(34.8,34.21) ; 35.69,33.32 36.58,34.21 U5.3 ; LCD1.2 65.28,69.77 65.91,69.14 69.98,69.14 71.54,67.58 U6.38
  Bottom Layer w0.508: v2(22.1,67.49) 20.7,66.09 9.53,66.09 6.48,63.04 6.48,35.99 8.38,34.09 16.51,34.09 18.29,32.31 v2(18.54,32.31) 20.45,34.21 v2(34.8,34.21)
VCC+5V: length 40.9
  Top Layer w0.508: SW18.4 56.26,5.76 54.48,7.54 51.31,7.54 50.78,7.01 USB1.A9 50.8,6.12 50.8,4.88 50.42,4.5 48.26,4.5 47.78,4.98 USB1.B9 47.78,7.14 47.37,7.54 35.56,7.54 34.42,8.69 34.42,11.73 33.78,12.37 29.59,12.37 28.96,11.73 U7.2
(no net):
  vias: v1(4.87,141.35) v1(5.13,16.18) v1(95.13,140.85) v1(95.13,16.18)
P00: length 37.8
  Top Layer w0.254: U6.37 72.39,56.76 72.39,58.85 72.9,59.43 72.9,72.06 72.01,72.95 52.96,72.95 52.58,72.57 LCD1.7
P01: length 42.8
  Top Layer w0.254: U6.36 73.14,58.02 74.04,58.92 74.04,72.69 73.22,73.52 50.48,73.52 50.04,73.08 LCD1.8
P02: length 48.1
  Top Layer w0.254: LCD1.9 47.37,71.3 47.37,73.58 47.88,74.09 74.55,74.09 75.31,73.33 75.31,58.92 73.94,57.55 U6.35
P03: length 53
  Top Layer w0.254: U6.34 74.74,57.34 76.45,59.05 76.45,73.71 75.44,74.73 45.47,74.73 44.83,74.09 44.83,71.3 LCD1.10
P04: length 73
  Top Layer w0.254: U6.33 76.47,55.12 78.81,57.45 84.2,57.45 85.09,58.34 85.09,74.85 84.65,75.3 43.37,75.3 42.42,74.35 LCD1.11
P05: length 79.4
  Top Layer w0.254: U6.32 77.37,54.18 77.72,54.53 77.72,55.1 78.94,56.31 84.84,56.31 85.79,57.26 85.79,75.3 85.09,76 40.89,76 39.88,74.98 LCD1.12
P06: length 85.1
  Top Layer w0.254: U6.31 77.27,53.38 78.94,55.04 85.6,55.04 86.36,55.8 86.36,76 85.73,76.63 38.61,76.63 37.34,75.36 LCD1.13
P07: length 91.2
  Top Layer w0.254: U6.30 77.74,52.58 78.94,53.77 85.73,53.77 87.12,55.17 87.12,76.76 86.61,77.27 36.07,77.27 34.8,76 LCD1.14
P20: length 44.8
  Top Layer w0.254: U6.18 71.5,45.2 71.5,34.21 70.9,33.61 61.44,33.61 60.13,32.31 60.13,27.29 58.93,26.09 47.88,26.09 46.48,24.69 U2.5
P21: length 45.5
  Top Layer w0.254: U2.6 47.75,24.05 48.77,25.07 59.82,25.07 60.96,26.21 60.96,31.55 61.98,32.56 72.14,32.56 72.9,33.32 72.9,42.4 72.34,42.96 U6.19
P23: length 77
  Top Layer w0.254: U6.21 73.94,43.9 75.31,42.52 75.31,18.08 73.79,16.56 32,16.56 31,17.57 R1.1
P25: length 54.2
  Top Layer w0.254: U6.23 82.36,46.98 83.31,47.93 v2(83.31,51.36) ; v2(66.29,66.98) 58.67,66.98 57.66,68 LCD1.5
  Bottom Layer w0.254: v2(66.29,66.98) 81.03,66.98 83.31,64.69 v2(83.31,51.36)
P26: length 46
  Top Layer w0.254: v2(80.26,47.8) 80.24,47.78 U6.24
  Bottom Layer w0.254: LCD1.4 60.2,67.61 62.61,65.2 79.63,65.2 80.9,63.93 80.9,48.44 v2(80.26,47.8)
P27: length 53.6
  Top Layer w0.254: v2(82.17,50.47) 82.17,49.2 81.55,48.58 U6.25 ; v2(66.29,66.09) 56.26,66.09 55.12,67.23 LCD1.6
  Bottom Layer w0.254: v2(82.17,50.47) 82.17,64.82 80.9,66.09 v2(66.29,66.09)
P30: length 152.8
  Top Layer w0.254: SW3.1 26.54,60.84 v2(26.54,57.84) ; v2(35.1,57.84) 35.05,57.88 SW4.1 ; v2(19.18,9.96) 20.07,10.85 20.07,11.99 20.7,12.62 25.53,12.62 26.16,11.99 U8.1 ; SW2.1 17.95,60.88 v2(17.95,57.84) ; v2(5.72,52.12) 5.72,57.45 6.1,57.84 v2(9.44,57.84) 9.44,60.58 9.57,60.71 SW1.1 ; v2(59.05,51.99) 62.03,51.99 62.25,51.78 65,51.78
  Bottom Layer w0.254: v2(5.72,52.12) 5.72,31.67 2.29,28.24 2.29,11.48 3.81,9.96 v2(19.18,9.96) ; v2(59.05,51.99) 57.66,53.39 57.66,56.44 56.26,57.84 v2(35.1,57.84) v2(26.54,57.84) v2(17.95,57.84) v2(9.44,57.84)
P31: length 186.4
  Top Layer w0.254: SW6.1 17.95,53.98 v2(17.95,51.03) ; 4.57,50.98 3.3,49.71 v2(3.3,40.69) ; 4.57,50.98 9.39,50.98 v2(9.44,51.03) 9.44,53.93 SW5.1 ; 4.57,50.98 3.3,52.25 3.3,72.82 4.83,74.35 26.04,74.35 27.18,73.2 LCD1.17 ; SW8.1 35.1,53.93 v2(35.1,51.03) ; SW7.1 26.5,50.97 v2(26.46,50.94) ; v2(21.72,9.19) 23.62,9.19 ; v2(55.5,50.98) 56.3,50.18 65,50.18
  Bottom Layer w0.254: v2(21.72,9.19) 3.43,9.19 1.4,11.23 1.4,28.63 3.3,30.53 v2(3.3,40.69) ; v2(9.44,51.03) v2(17.95,51.03) 26.37,51.03 v2(26.46,50.94) 26.55,51.03 v2(35.1,51.03) 55.45,51.03 v2(55.5,50.98)
P32: length 142.9
  Top Layer w0.254: v2(26.46,44.04) 26.5,44.07 SW11.1 ; v2(35.1,44.08) 35.05,44.13 SW12.1 ; SW10.1 17.95,44.09 v2(17.95,44.08) ; 65,49.38 64.88,49.5 63.23,49.5 62.16,48.44 57.02,48.44 56.13,47.55 56.13,44.63 55.5,43.99 v2(41.4,43.99) ; v2(1.65,49.71) 1.65,73.46 3.94,75.74 30.86,75.74 32.26,74.35 LCD1.15 ; v2(4.45,43.99) 4.48,43.96 v2(9.32,43.96) 9.32,47 SW9.1
  Bottom Layer w0.254: v2(41.4,43.99) 41.36,44.04 v2(26.46,44.04) 26.41,44.08 v2(17.95,44.08) 17.83,43.96 v2(9.32,43.96) ; v2(1.65,49.71) 1.65,46.79 v2(4.45,43.99)
P33: length 149.9
  Top Layer w0.254: SW15.1 26.5,37.22 v2(26.42,37.13) ; v2(35.1,37.13) 35.05,37.18 SW16.1 ; 65,48.58 63.7,48.58 62.03,46.91 57.28,46.91 56.77,46.41 v2(56.77,40.31) ; LCD1.16 29.72,73.46 28.19,74.98 4.32,74.98 2.54,73.2 2.54,39.29 4.7,37.13 v2(10.33,37.13) 9.4,38.07 SW13.1 ; v2(17.95,37.13) 17.95,40.18 SW14.1
  Bottom Layer w0.254: v2(10.33,37.13) v2(17.95,37.13) v2(26.42,37.13) v2(35.1,37.13) 55.12,37.13 56.77,38.79 v2(56.77,40.31)
P34: length 101.5
  Top Layer w0.254: SW9.2 SW5.2 SW1.2 ; SW9.2 SW13.2 13.46,40.18 13.46,37.01 14.55,35.92 19.63,35.92 21.34,34.21 21.34,25.96 22.23,25.07 U4.6 ; SW9.2 15.58,47.08 v2(15.62,47.04) ; v2(58.55,46.15) 59.05,45.64 62.03,45.64 64.17,47.78 65,47.78
  Bottom Layer w0.254: v2(15.62,47.04) 15.62,48.82 16.32,49.52 56.58,49.52 57.28,48.82 57.28,46.79 57.91,46.15 v2(58.55,46.15)
P35: length 88.9
  Top Layer w0.254: 65,46.98 62.4,44.37 59.31,44.37 v2(58.55,43.61) ; v2(26.54,32.69) 26.54,35.23 25.4,36.37 23.24,36.37 22.02,37.6 SW14.2 SW10.2 ; SW10.2 SW6.2 SW2.2 ; SW10.2 24.09,47.08 v2(24.13,47.04) ; v2(26.54,25.45) 26.54,24.69 25.65,23.8 U4.5
  Bottom Layer w0.254: v2(58.55,43.61) 55.75,43.61 54.74,44.63 54.74,46.15 53.85,47.04 v2(24.13,47.04) ; v2(26.54,25.45) v2(26.54,32.69)
P36: length 84.6
  Top Layer w0.254: SW15.2 30.57,28.08 28.83,26.34 U4.7 ; SW15.2 32.13,40.18 32.64,40.69 v2(32.64,41.45) ; SW15.2 SW11.2 SW7.2 SW3.2 ; U6.12 66.67,45.18 66.67,40.94 65.53,39.8 v2(62.36,39.8)
  Bottom Layer w0.254: v2(32.64,41.45) 32.64,41.96 33.27,42.6 59.05,42.6 59.69,41.96 59.69,40.69 60.58,39.8 v2(62.36,39.8)
P37: length 61.5
  Top Layer w0.254: 39.88,38.15 38.99,39.04 38.99,40.06 SW16.2 SW12.2 SW8.2 SW4.2 ; 39.88,38.15 38.99,37.26 U5.2 ; 39.88,38.15 66.29,38.15 67.54,39.4 U6.13
RST: length 74
  Top Layer w0.254: v2(91.69,33.83) 93.9,33.83 C6.2 R4.2 97.88,33.74 98.93,32.69 98.93,23.16 97.96,22.19 SW17.1 ; 65,52.58 64.95,52.63 v2(62.99,52.63)
  Bottom Layer w0.254: v2(91.69,33.83) 66.04,33.83 65.09,34.79 65.09,40.88 64.26,41.71 62.61,41.71 60.58,43.74 60.58,51.49 61.72,52.63 v2(62.99,52.63)
XTAL2: length 22.6
  Top Layer w0.254: v2(77.09,43.48) C7.1 79.64,40.42 80.59,39.47 U3.1 ; v2(68.33,43.87) 68.33,45.23 U6.14
  Bottom Layer w0.254: v2(77.09,43.48) 68.71,43.48 v2(68.33,43.87)
XYAL1: length 38.7
  Top Layer w0.254: v2(77.85,37.01) 79.57,37.01 C8.1 79.64,35.85 80.52,34.98 93.6,34.98 95,36.37 95,39.41 U3.2 ; U6.15 69.14,37.97 v2(70.1,37.01)
  Bottom Layer w0.254: v2(70.1,37.01) v2(77.85,37.01)
$1N2520: length 7.5
  Top Layer w0.254: R1.2 38.23,21.51 38.67,21.96 Q1.1
$1N2524: length 42.4
  Top Layer w0.254: Q1.3 37.72,18.97 38.48,18.21 70.99,18.21 72.01,19.23 72.01,24.68 BUZZER1.1
$1N3833: length 16.9
  Top Layer w0.254: C1.2 5.65,28.94 6.22,29.51 11.04,29.51 X1.1 15.74,29.52 16.38,28.88 16.38,26.97 17.02,26.34 U4.2
$1N3840: length 18.7
  Top Layer w0.254: U4.3 17.02,25.07 16.38,24.43 16.38,21.26 15.74,20.62 11.05,20.62 11.04,20.62 7.24,20.62 6.6,21.26 6.6,22.37 C2.2
$1N9572: length 4.6
  Top Layer w0.254: USB1.B5 49.78,7.54 50.67,8.44 R2.1
$1N9573: length 4.6
  Top Layer w0.254: USB1.A5 48.78,7.54 47.88,8.43 R5.1
$1N9582: length 3.8
  Top Layer w0.254: LED1.2 87.36,5.31 R3.2

## Copper pours and planes (outline as drawn; the poured copper is in the pictures)
GND on Top Layer: -18.16,159.82 120.9,159.82 120.9,-28.27 -18.16,-28.27

Small or netless copper shapes (teardrops, artwork), in the pictures only: 218 on Top Layer, 61 on Bottom Layer

## Text on the board
Top Silkscreen Layer: P31 | P30 | VCC | GND
